# Altium schematic sheet Toplevel.SchDoc
size A4
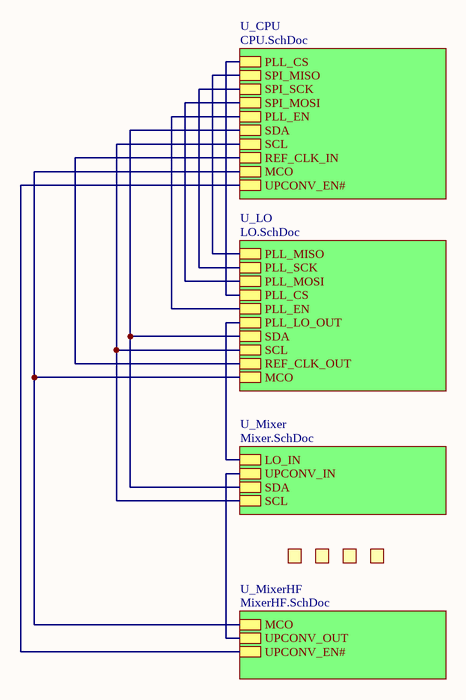
[diagram p0: Toplevel.SchDoc]

## Parts
H1  MOUNTHOLE_3MM  [MOUNT_3MM]  (value not drawn)
H2  MOUNTHOLE_3MM  [MOUNT_3MM]  (value not drawn)
H3  MOUNTHOLE_3MM  [MOUNT_3MM]  (value not drawn)
H4  MOUNTHOLE_3MM  [MOUNT_3MM]  (value not drawn)

## Sub-sheets
U_CPU = CPU.SchDoc: PLL_CS, SPI_MISO, SPI_SCK, SPI_MOSI, PLL_EN, SDA, SCL, REF_CLK_IN, MCO, UPCONV_EN#
U_LO = LO.SchDoc: PLL_MISO, PLL_SCK, PLL_MOSI, PLL_CS, PLL_EN, PLL_LO_OUT, SDA, SCL, REF_CLK_OUT, MCO
U_Mixer = Mixer.SchDoc: LO_IN, UPCONV_IN, SDA, SCL
U_MixerHF = MixerHF.SchDoc: MCO, UPCONV_OUT, UPCONV_EN#

## Nets
(unnamed): sheet U_CPU/PLL_CS, sheet U_LO/PLL_CS
(unnamed): sheet U_CPU/SPI_MISO, sheet U_LO/PLL_MISO
(unnamed): sheet U_CPU/SPI_SCK, sheet U_LO/PLL_SCK
(unnamed): sheet U_CPU/SPI_MOSI, sheet U_LO/PLL_MOSI
(unnamed): sheet U_CPU/PLL_EN, sheet U_LO/PLL_EN
(unnamed): sheet U_CPU/SDA, sheet U_Mixer/SDA, sheet U_LO/SDA
(unnamed): sheet U_CPU/SCL, sheet U_Mixer/SCL, sheet U_LO/SCL
(unnamed): sheet U_CPU/REF_CLK_IN, sheet U_LO/REF_CLK_OUT
(unnamed): sheet U_CPU/MCO, sheet U_MixerHF/MCO, sheet U_LO/MCO
(unnamed): sheet U_CPU/UPCONV_EN#, sheet U_MixerHF/UPCONV_EN#
(unnamed): sheet U_Mixer/LO_IN, sheet U_LO/PLL_LO_OUT
(unnamed): sheet U_Mixer/UPCONV_IN, sheet U_MixerHF/UPCONV_OUT